# Altium project DM1092_R0M0E0.PrjPcb (part 4 of 4)
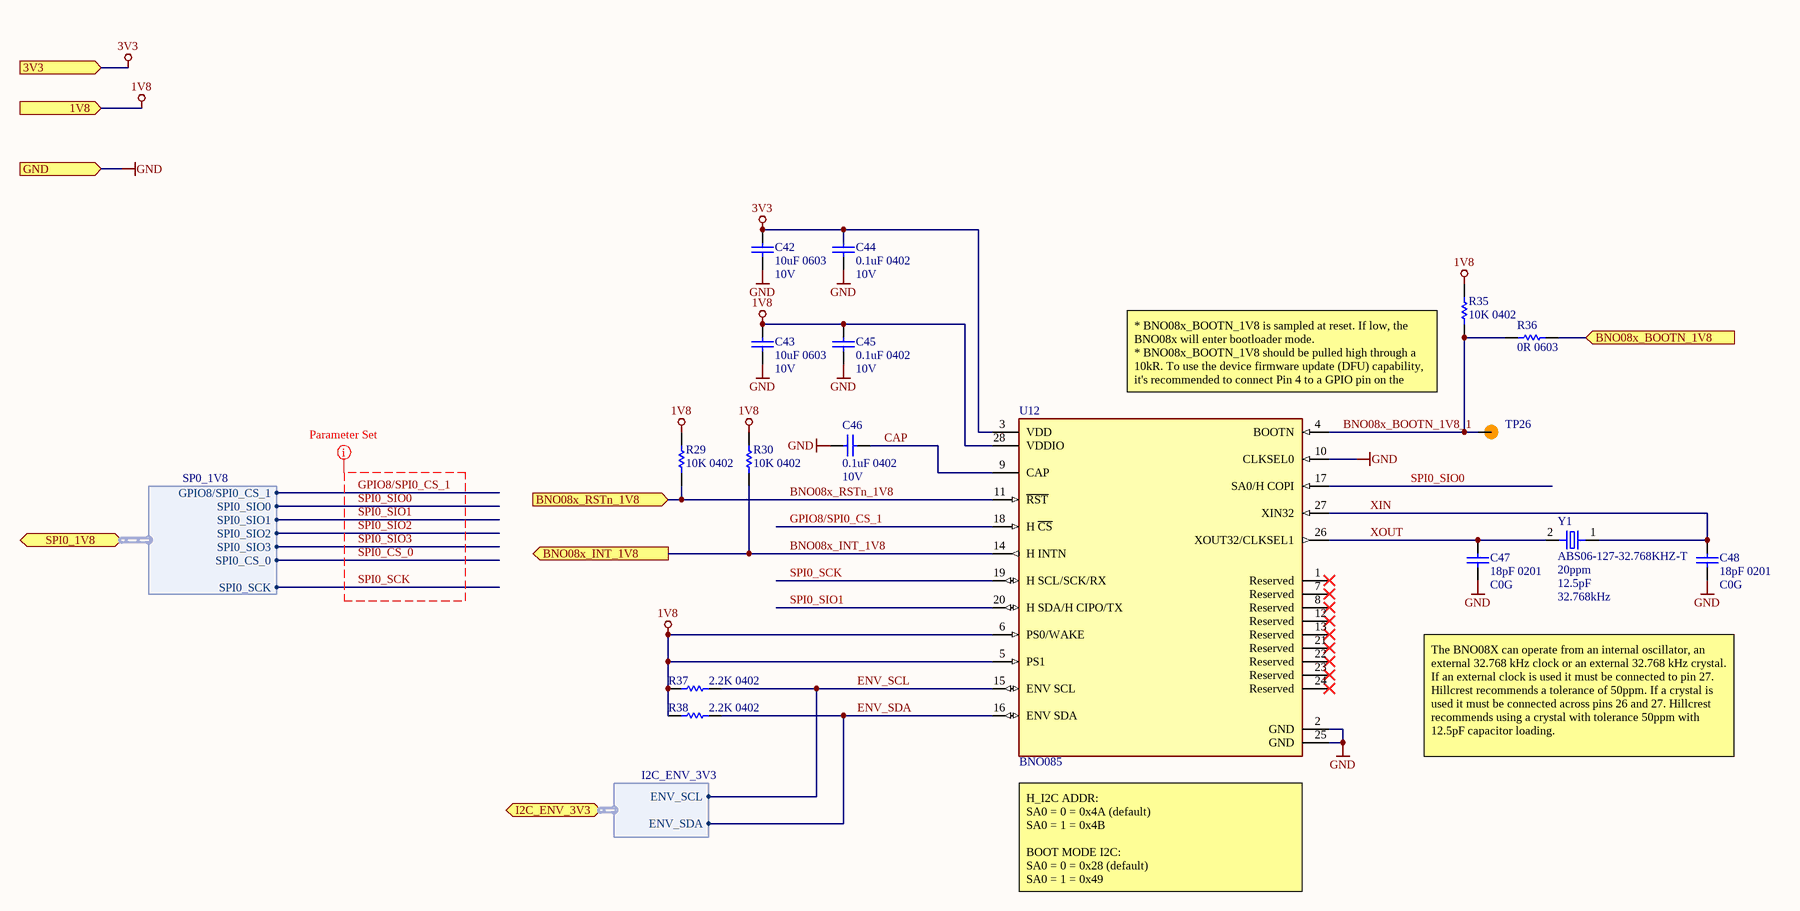
[diagram p5: DM1092_IMU.SchDoc]

## Nets that join several sheets
1V8: DM1092_Power_Supply (C18.2 TP11.1 U2.5), DM1092_IMU (10 pins)
3V3: DM1092_Power_Supply (C16.1 L2.2 R5.2), DM1092_ESP32 (5 pins), DM1092_IMU (C42.2 C44.2 U12.3)
GND: DM1092_TopLevel (MP5.1 MP6.1 MP7.1 MP8.1), DM1092_Power_Supply (34 pins), DM1092_ESP32 (23 pins), DM1092_IMU (10 pins)

## Assembly variants
Production: not fitted J5 J6 J12 MISC1 R18 R19